# Altium schematic sheet DAP_board.SchDoc
size A4; SheetNumber: 6; SheetTotal: 6
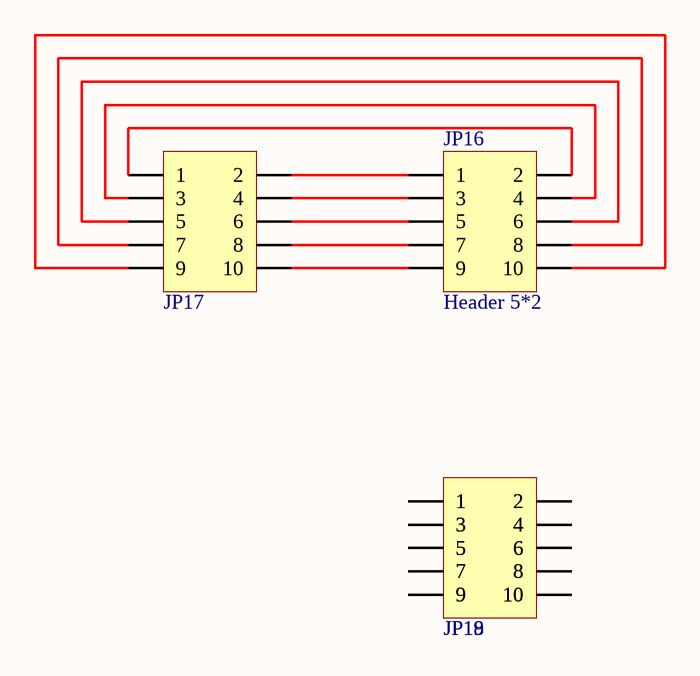
[diagram p0: DAP_board.SchDoc]

## Parts
JP16  Header 5*2  [BTB-0.8MM-SMD-BM-2*5PIN]
JP17  Header 5X2  [HDR1.27-M-LS-2x5P]  (value not drawn)
JP18  Header 5X2  [HDR2.54-M-LS-2x5P]  (value not drawn)
JP19  Header 5X2  [HDR1.27-M-LS-2x5P]  (value not drawn)

## Nets
NetJP16_1: JP16.1 JP17.2
NetJP16_2: JP16.2 JP17.1
NetJP16_3: JP16.3 JP17.4
NetJP16_4: JP16.4 JP17.3
NetJP16_5: JP16.5 JP17.6
NetJP16_6: JP16.6 JP17.5
NetJP16_7: JP16.7 JP17.8
NetJP16_8: JP16.8 JP17.7
NetJP16_9: JP16.9 JP17.10
NetJP16_10: JP16.10 JP17.9
NetJP18_1: JP18.1 JP19.1
NetJP18_2: JP18.2 JP19.2
NetJP18_3: JP18.3 JP19.3
NetJP18_4: JP18.4 JP19.4
NetJP18_5: JP18.5 JP19.5
NetJP18_6: JP18.6 JP19.6
NetJP18_7: JP18.7 JP19.7
NetJP18_8: JP18.8 JP19.8
NetJP18_9: JP18.9 JP19.9
NetJP18_10: JP18.10 JP19.10

## Library data of the parts
JP16 = Header 5*2: BTB Connector
JP17-JP19 = Header 5X2: 5*2P接插件; 版权归属: 封装库来自淘宝 ID：黄晶宝石; BOM名称: 5*2P接插件; 学习资源: https://shop463601444.taobao.com